# EAGLE design IceWerx Carrier Enzo Florendo (EAGLE 9.6.2)
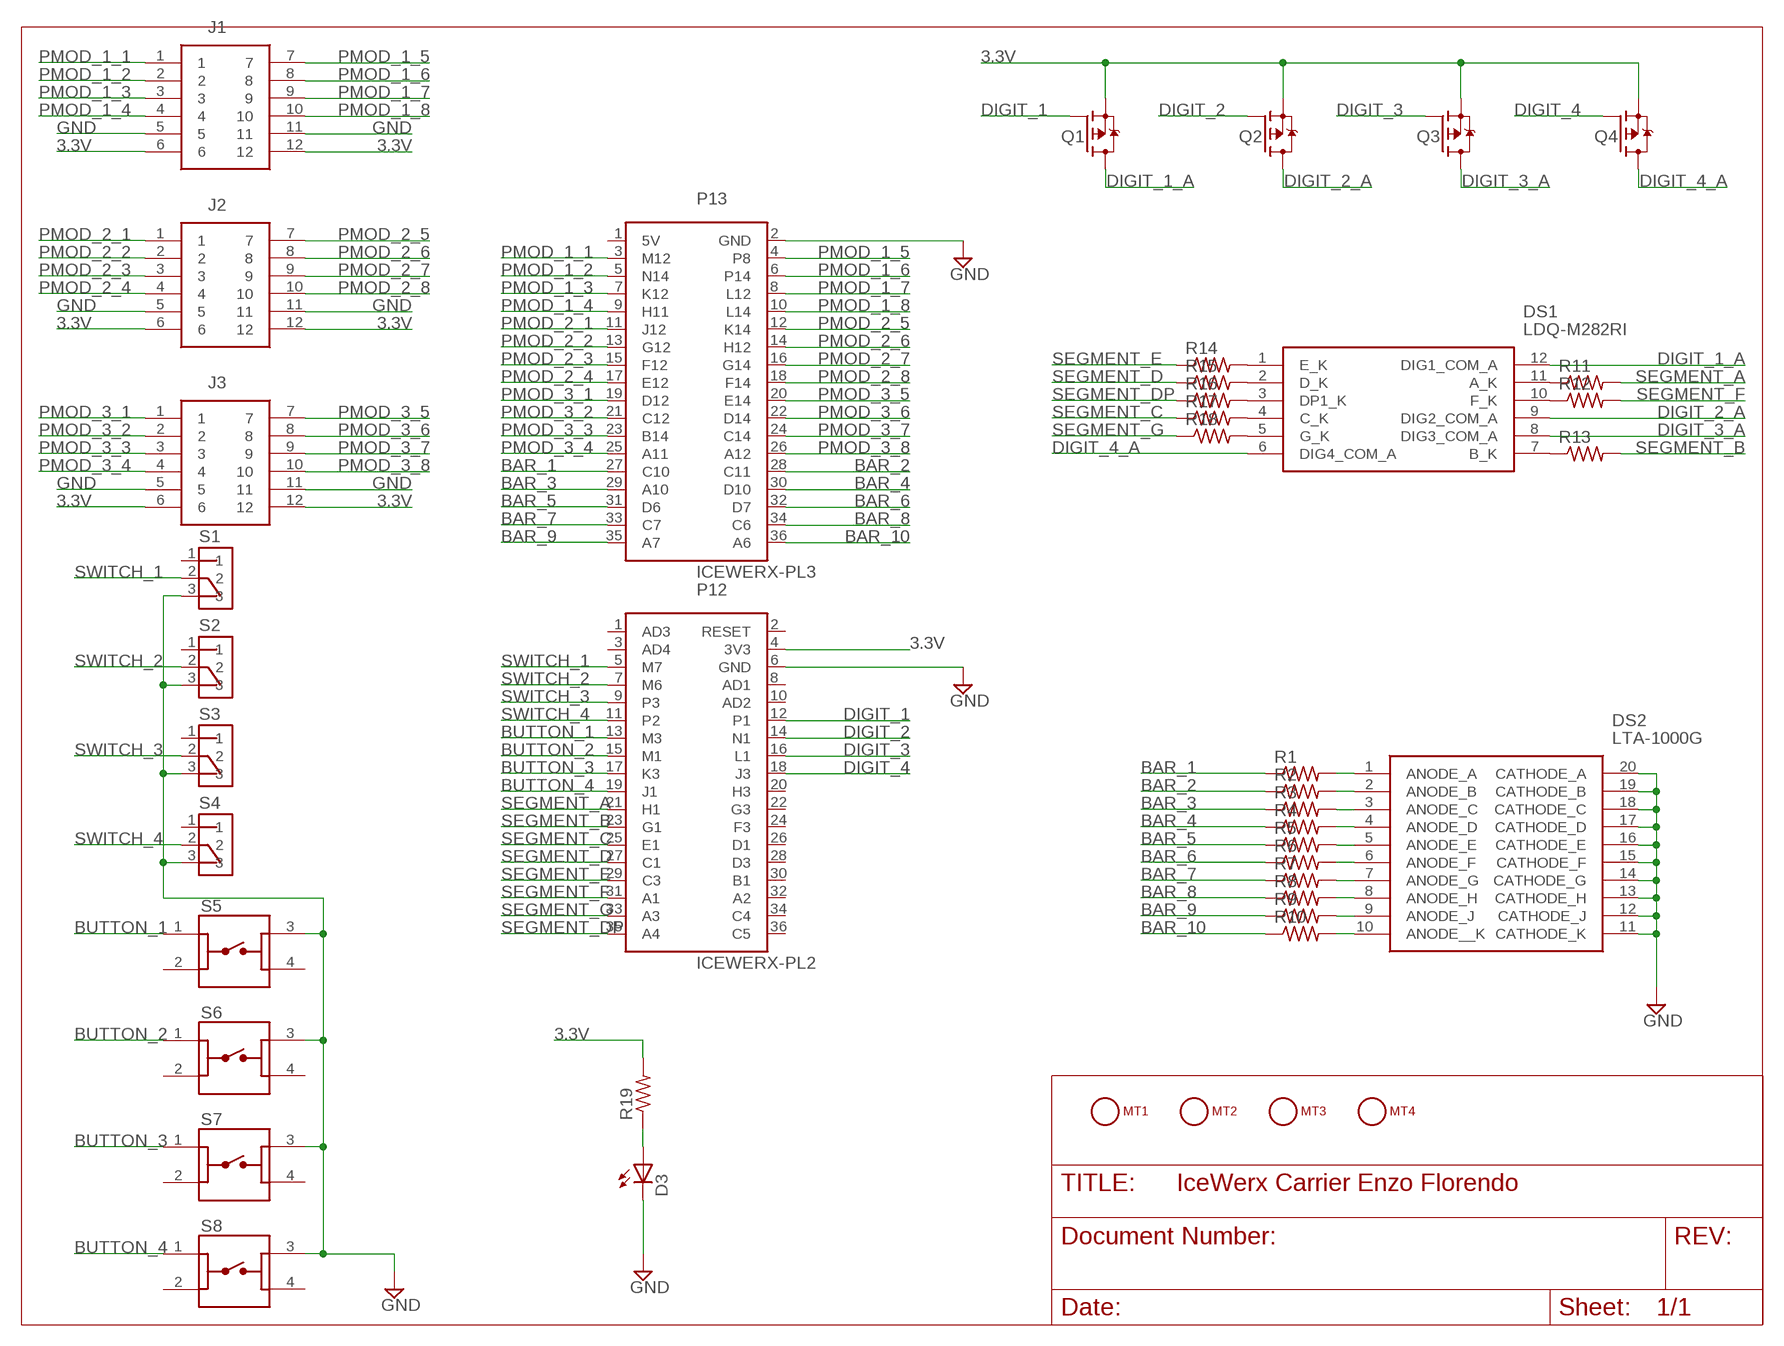
[diagram p0: schematic, sheet 1]

## Parts
D3  LED5MM  [LED5MM]
DS1  LDQ-M282RI  [LDQM282RI]
DS2  LTA-1000G  [DIPS762W50P254L2527H825Q20N]
J1  PMOD-SOCKET-FOR-HOST-BOARD  [PMOD-SOCKET-FOR-HOST-BOARD]
J2  PMOD-SOCKET-FOR-HOST-BOARD  [PMOD-SOCKET-FOR-HOST-BOARD]
J3  PMOD-SOCKET-FOR-HOST-BOARD  [PMOD-SOCKET-FOR-HOST-BOARD]
MT1  MOUNTING_HOLE-125_250_ROUND  [MT_125_250]
MT2  MOUNTING_HOLE-125_250_ROUND  [MT_125_250]
MT3  MOUNTING_HOLE-125_250_ROUND  [MT_125_250]
MT4  MOUNTING_HOLE-125_250_ROUND  [MT_125_250]
P12  ICEWERX-PL2  [TE_4-1734506-1]
P13  ICEWERX-PL3  [TE_4-1734506-1]
Q1  NX2301P  [SOT95P230X110-3N]
Q2  NX2301P  [SOT95P230X110-3N]
Q3  NX2301P  [SOT95P230X110-3N]
Q4  NX2301P  [SOT95P230X110-3N]
R1  R-US_0204/5  [0204/5]
R2  R-US_0204/5  [0204/5]
R3  R-US_0204/5  [0204/5]
R4  R-US_0204/5  [0204/5]
R5  R-US_0204/5  [0204/5]
R6  R-US_0204/5  [0204/5]
R7  R-US_0204/5  [0204/5]
R8  R-US_0204/5  [0204/5]
R9  R-US_0204/5  [0204/5]
R10  R-US_0204/5  [0204/5]
R11  R-US_0204/5  [0204/5]
R12  R-US_0204/5  [0204/5]
R13  R-US_0204/5  [0204/5]
R14  R-US_0204/5  [0204/5]
R15  R-US_0204/5  [0204/5]
R16  R-US_0204/5  [0204/5]
R17  R-US_0204/5  [0204/5]
R18  R-US_0204/5  [0204/5]
R19  R-US_0204/5  [0204/5]
S1  OS102011MS2QN1  [SW_OS102011MS2QN1]
S2  OS102011MS2QN1  [SW_OS102011MS2QN1]
S3  OS102011MS2QN1  [SW_OS102011MS2QN1]
S4  OS102011MS2QN1  [SW_OS102011MS2QN1]
S5  1825910-7  [SW_1825910-7]
S6  1825910-7  [SW_1825910-7]
S7  1825910-7  [SW_1825910-7]
S8  1825910-7  [SW_1825910-7]

## Nets
3.3V: J1.6 J1.12 J2.6 J2.12 J3.6 J3.12 P12.4(3V3) Q1.2(S) Q2.2(S) Q3.2(S) Q4.2(S) R19.2
BAR_1: P13.27(C10) R1.1
BAR_2: P13.28(C11) R2.1
BAR_3: P13.29(A10) R3.1
BAR_4: P13.30(D10) R4.1
BAR_5: P13.31(D6) R5.1
BAR_6: P13.32(D7) R6.1
BAR_7: P13.33(C7) R7.1
BAR_8: P13.34(C6) R8.1
BAR_9: P13.35(A7) R9.1
BAR_10: P13.36(A6) R10.1
BUTTON_1: P12.13(M3) S5.1
BUTTON_2: P12.15(M1) S6.1
BUTTON_3: P12.17(K3) S7.1
BUTTON_4: P12.19(J1) S8.1
DIGIT_1: P12.12(P1) Q1.1(G)
DIGIT_1_A: DS1.12(DIG1_COM_A) Q1.3(D)
DIGIT_2: P12.14(N1) Q2.1(G)
DIGIT_2_A: DS1.9(DIG2_COM_A) Q2.3(D)
DIGIT_3: P12.16(L1) Q3.1(G)
DIGIT_3_A: DS1.8(DIG3_COM_A) Q3.3(D)
DIGIT_4: P12.18(J3) Q4.1(G)
DIGIT_4_A: DS1.6(DIG4_COM_A) Q4.3(D)
GND: D3.K(C) DS2.11(CATHODE_K) DS2.12(CATHODE_J) DS2.13(CATHODE_H) DS2.14(CATHODE_G) DS2.15(CATHODE_F) DS2.16(CATHODE_E) DS2.17(CATHODE_D) DS2.18(CATHODE_C) DS2.19(CATHODE_B) DS2.20(CATHODE_A) J1.5 J1.11 J2.5 J2.11 J3.5 J3.11 P12.6(GND) P13.2(GND) S1.3 S2.3 S3.3 S4.3 S5.3 S6.3 S7.3 S8.3
N$3: D3.A R19.1
N$4: DS2.1(ANODE_A) R1.2
N$5: DS2.2(ANODE_B) R2.2
N$6: DS2.3(ANODE_C) R3.2
N$7: DS2.4(ANODE_D) R4.2
N$8: DS2.5(ANODE_E) R5.2
N$9: DS2.6(ANODE_F) R6.2
N$10: DS2.7(ANODE_G) R7.2
N$11: DS2.8(ANODE_H) R8.2
N$12: DS2.9(ANODE_J) R9.2
N$13: DS2.10(ANODE__K) R10.2
N$14: DS1.11(A_K) R11.1
N$15: DS1.10(F_K) R12.1
N$16: DS1.7(B_K) R13.1
N$17: DS1.1(E_K) R14.2
N$18: DS1.2(D_K) R15.2
N$19: DS1.3(DP1_K) R16.2
N$20: DS1.4(C_K) R17.2
N$21: DS1.5(G_K) R18.2
PMOD_1_1: J1.1 P13.3(M12)
PMOD_1_2: J1.2 P13.5(N14)
PMOD_1_3: J1.3 P13.7(K12)
PMOD_1_4: J1.4 P13.9(H11)
PMOD_1_5: J1.7 P13.4(P8)
PMOD_1_6: J1.8 P13.6(P14)
PMOD_1_7: J1.9 P13.8(L12)
PMOD_1_8: J1.10 P13.10(L14)
PMOD_2_1: J2.1 P13.11(J12)
PMOD_2_2: J2.2 P13.13(G12)
PMOD_2_3: J2.3 P13.15(F12)
PMOD_2_4: J2.4 P13.17(E12)
PMOD_2_5: J2.7 P13.12(K14)
PMOD_2_6: J2.8 P13.14(H12)
PMOD_2_7: J2.9 P13.16(G14)
PMOD_2_8: J2.10 P13.18(F14)
PMOD_3_1: J3.1 P13.19(D12)
PMOD_3_2: J3.2 P13.21(C12)
PMOD_3_3: J3.3 P13.23(B14)
PMOD_3_4: J3.4 P13.25(A11)
PMOD_3_5: J3.7 P13.20(E14)
PMOD_3_6: J3.8 P13.22(D14)
PMOD_3_7: J3.9 P13.24(C14)
PMOD_3_8: J3.10 P13.26(A12)
SEGMENT_A: P12.21(H1) R11.2
SEGMENT_B: P12.23(G1) R13.2
SEGMENT_C: P12.25(E1) R17.1
SEGMENT_D: P12.27(C1) R15.1
SEGMENT_DP: P12.35(A4) R16.1
SEGMENT_E: P12.29(C3) R14.1
SEGMENT_F: P12.31(A1) R12.2
SEGMENT_G: P12.33(A3) R18.1
SWITCH_1: P12.5(M7) S1.2
SWITCH_2: P12.7(M6) S2.2
SWITCH_3: P12.9(P3) S3.2
SWITCH_4: P12.11(P2) S4.2
Unconnected: MT1.1 MT2.1 MT3.1 MT4.1 P12.1(AD3) P12.2(RESET) P12.3(AD4) P12.8(AD1) P12.10(AD2) P12.20(H3) P12.22(G3) P12.24(F3) P12.26(D1) P12.28(D3) P12.30(B1) P12.32(A2) P12.34(C4) P12.36(C5) P13.1(5V) S1.1 S2.1 S3.1 S4.1 S5.2 S5.4 S6.2 S6.4 S7.2 S7.4 S8.2 S8.4

## Library data of the parts
D3 = eagle-library-engr-240-f22:LED: LED OSRAM: - CHIPLED LG R971, LG N971, LY N971, LG Q971, LY Q971, LO R971, LY R971 LH N974, LH R974 LS Q976, LO Q976, LY Q976 LO Q996 - Hyper CHIPLED LW Q18S LB Q993, LB Q99A, LB R99A - SideLED LS A670, LO A670, LY A670, LG A670, LP A670 LB A673, LV A673, LT A673, LW A673 LH A674 LY A675 LS A676, LA A676, LO A676, LY A676, LW A676 LS A679, LY A679, LG A679 - Hyper Micro SIDELED® LS Y876, LA Y876, LO Y876, LY Y876 LT Y87S - SmartLED LW L88C, LW L88S LB L89C, LB L89S, LG L890 LS L89K, LO L89K, LY L89K LS L896, LA L896, LO L896, LY L896 - TOPLED LS T670, LO T670, LY T670, LG T670, LP T670 LSG T670, LSP T670, LSY T670, LOP T670, LYG T670 LG T671, LOG T671, LSG T671 LB T673, LV T673, LT T673, LW T673 LH T674 LS T676, LA T676, LO T676, LY T676, LB T676, LH T676, LSB T676, LW T676 LB T67C, LV T67C, LT T67C, LS T67K, LO T67K, LY T67K, LW E67C LS E67B, LA E67B, LO E67B, LY E67B, LB E67C, LV E67C, LT E67C LW T67C LS T679, LY T679, LG T679 LS T770, LO T770, LY T770, LG T770, LP T770 LB T773, LV T773, LT T773, LW T773 LH T774 LS E675, LA E675, LY E675, LS T675 LS T776, LA T776, LO T776, LY T776, LB T776 LHGB T686 LT T68C, LB T68C - Hyper Mini TOPLED® LB M676 - Mini TOPLED Santana® LG M470 LS M47K, LO M47K, LY M47K Source: http://www.osram.convergy.de/
DS1 = eagle-library-engr-240-f22:LDQ-M282RI: LED Displays & Accessories LED Display Source: Datasheet <https://componentsearchengine.com/Datasheets/1/LDQ-M282RI.pdf>; DESCRIPTION: LED Displays & Accessories LED Display; HEIGHT: 6.05mm; MANUFACTURER_NAME: Lumex; MANUFACTURER_PART_NUMBER: LDQ-M282RI; MOUSER_PART_NUMBER: 696-LDQ-M282RI; MOUSER_PRICE-STOCK: https://www.mouser.com/Search/Refine.aspx?Keyword=696-LDQ-M282RI
DS2 = eagle-library-engr-240-f22:LTA-1000G: LED Uni-Color Green 565nm 20-Pin PDIP Source: Datasheet <https://optoelectronics.liteon.com/upload/download/DS-30-92-0809/A1000G.pdf>; DESCRIPTION: LED Uni-Color Green 565nm 20-Pin PDIP; HEIGHT: 8.25mm; MANUFACTURER_NAME: Lite-On; MANUFACTURER_PART_NUMBER: LTA-1000G; MOUSER_PART_NUMBER: 859-LTA-1000G; MOUSER_PRICE-STOCK: https://www.mouser.co.uk/ProductDetail/Lite-On/LTA-1000G?qs=%2FTKcI5XXRKq0QINzVmwJHg%3D%3D
J1-J3 = eagle-library-engr-240-f22:PMOD-SOCKET-FOR-HOST-BOARD
MT1-MT4 = eagle-library-engr-240-f22:MOUNTING_HOLE
P12 = eagle-library-engr-240-f22:ICEWERX-PL2
P13 = eagle-library-engr-240-f22:ICEWERX-PL3
Q1-Q4 = eagle-library-engr-240-f22:NX2301P; MANUFACTURER: Nexperia; MAXIMUM_PACKAGE_HEIGHT: 1.10 mm; PARTREV: 1; SNAPEDA_PN: NX2301P; STANDARD: IPC 7351B
R1-R19 = eagle-library-engr-240-f22:R-US_: RESISTOR, American symbol
S1-S4 = eagle-library-engr-240-f22:OS102011MS2QN1: Switch Slide ON ON SPDT Top Slide 0.1A 12VDC 10000Cycles PC Pins Thru-Hole Bulk; MANUFACTURER: C&K; STANDARD: MANUFACTURER RECOMMENDATIONS
S5-S8 = eagle-library-engr-240-f22:1825910-7: Switch Tactile OFF (ON) SPST Round Button PC Pins 0.05A 24VDC 100000Cycles 2.55N Thru-Hole Loose; MANUFACTURER: TE Connectivity; PARTREV: C10; STANDARD: Manufacturer Recommendation

## Board
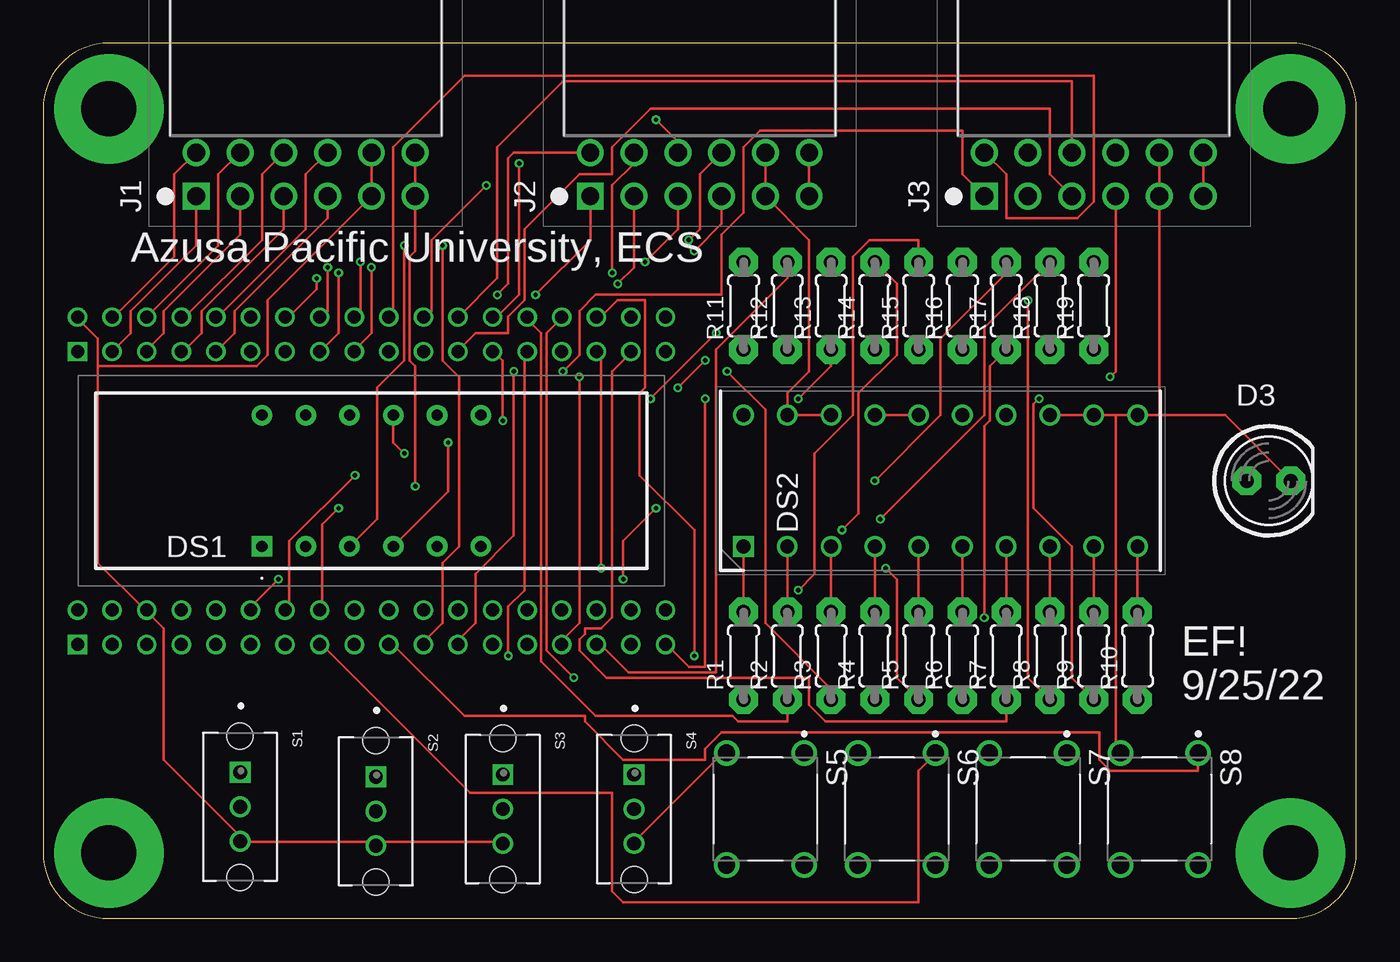
[diagram p1: board, top side]
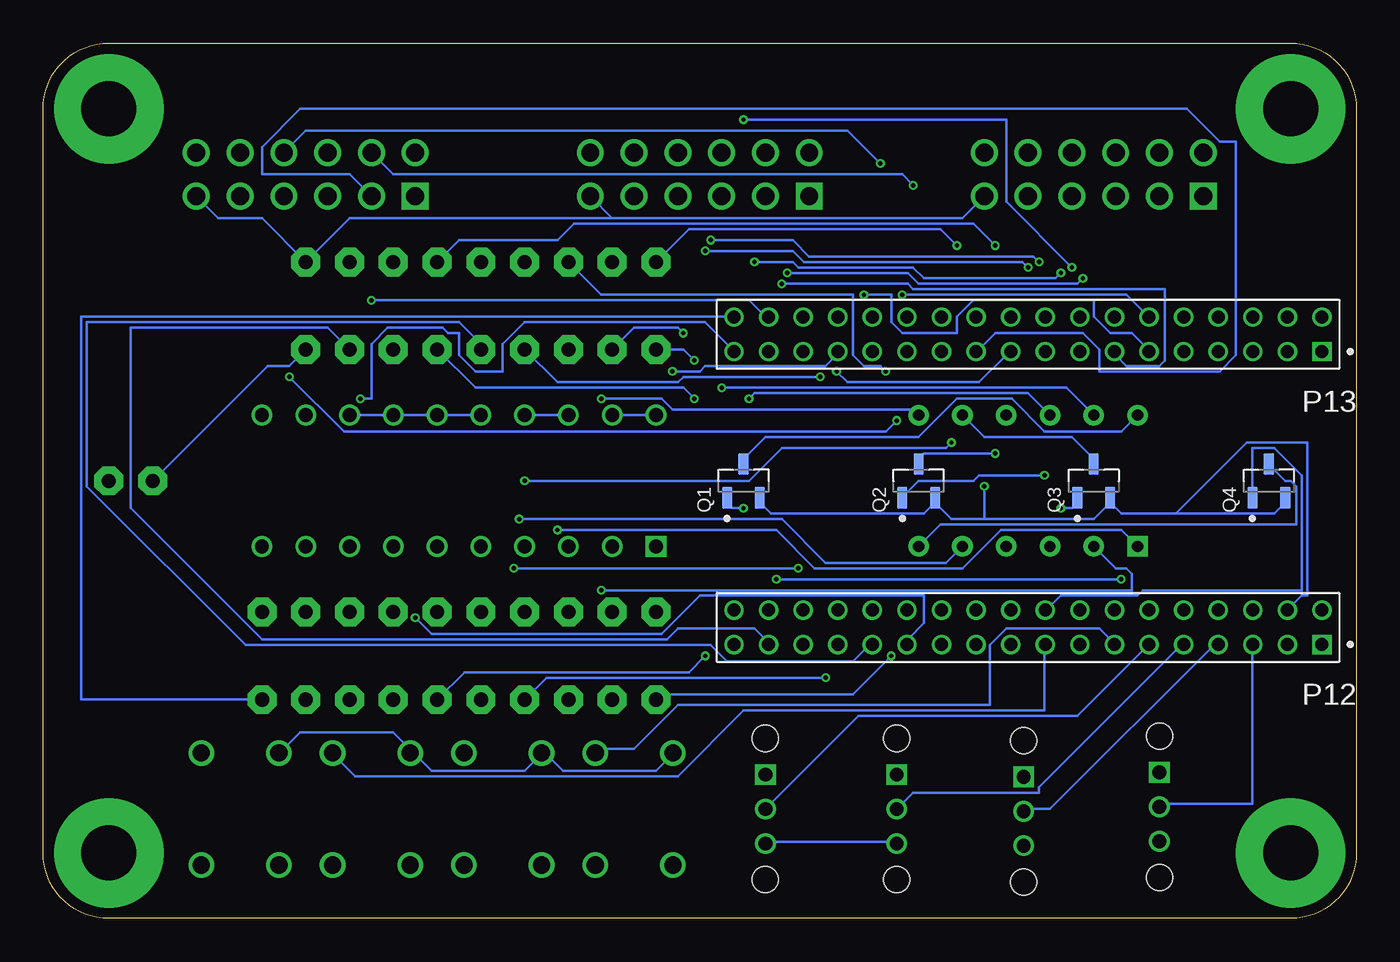
[diagram p2: board, bottom side, seen from below]

Size 76.2 x 50.8 mm. Coordinates in mm from the lower left corner, seen from the top.
Outline: 0,3.81 arc90 3.81,0 72.39,0 arc90 76.2,3.81 76.2,46.99 arc90 72.39,50.8 3.81,50.8 arc90 0,46.99 0,3.81
Copper layers (1*16): Top 0.035559375mm / dielectric 1.6mm / Bottom 0.035559375mm
Design rules "oshpark-2layer *": minimum track width 6mil, minimum drill 10mil, track to track 6mil, track to pad 6mil, pad to pad 6mil, via to via 6mil, smd to smd 6mil, copper to edge 15mil, drill to drill 6mil, minimum pad ring 5mil, minimum via ring 5mil, stop-mask expansion 2.5mil, vias tented up to drill 15mil, thermal gap 10mil

### Footprints (pad centres in the part's own frame; a part is rotated, then mirrored left to right if it is on the bottom)
LED5MM = drill 0.813 pad 1.676 octagon: A -1.27,0; K 1.27,0
LDQM282RI = drill 0.65 pad 1.192 square: 1 0,0 | drill 0.65 pad 1.192: 2 2.54,0; 3 5.08,0; 4 7.62,0; 5 10.16,0; 6 12.7,0; 7 12.7,7.62; 8 10.16,7.62; 9 7.62,7.62; 10 5.08,7.62; 11 2.54,7.62; 12 0,7.62
DIPS762W50P254L2527H825Q20N = drill 0.8 pad 1.2 square: 1 0,0 | drill 0.8 pad 1.2: 2 0,-2.54; 3 0,-5.08; 4 0,-7.62; 5 0,-10.16; 6 0,-12.7; 7 0,-15.24; 8 0,-17.78; 9 0,-20.32; 10 0,-22.86; 11 7.62,-22.86; 12 7.62,-20.32; 13 7.62,-17.78; 14 7.62,-15.24; 15 7.62,-12.7; 16 7.62,-10.16; 17 7.62,-7.62; 18 7.62,-5.08; 19 7.62,-2.54; 20 7.62,0
PMOD-SOCKET-FOR-HOST-BOARD = drill 1.04 pad 1.55 square: 1 0,0 | drill 1.04 pad 1.55: 2 2.54,0; 3 5.08,0; 4 7.62,0; 5 10.16,0; 6 12.7,0; 7 0,2.54; 8 2.54,2.54; 9 5.08,2.54; 10 7.62,2.54; 11 10.16,2.54; 12 12.7,2.54
MT_125_250 = drill 3.175 pad 6.35: 1 0,0
TE_4-1734506-1 = drill 0.75 pad 1.1 square: 1 0,0 | drill 0.75 pad 1.1: 2 0,-2; 3 2.007,0; 4 2.007,-2; 5 4.013,0; 6 4.013,-2; 7 6.02,0; 8 6.02,-2; 9 8.026,0; 10 8.026,-2; 11 10.033,0; 12 10.033,-2; 13 12.04,0; 14 12.04,-2; 15 14.046,0; 16 14.046,-2; 17 16.053,0; 18 16.053,-2; 19 18.059,0; 20 18.059,-2; 21 20.066,0; 22 20.066,-2; 23 22.073,0; 24 22.073,-2; 25 24.079,0; 26 24.079,-2; 27 26.086,0; 28 26.086,-2; 29 28.092,0; 30 28.092,-2; 31 30.099,0; 32 30.099,-2; 33 32.106,0; 34 32.106,-2; 35 34.112,0; 36 34.112,-2
SOT95P230X110-3N = smd 1.26 x 0.59: 1 -0.98,0.95; 2 -0.98,-0.95; 3 0.98,0
0204/5 = drill 0.813 pad 1.676 octagon: 1 -2.54,0; 2 2.54,0
SW_OS102011MS2QN1 = drill 0.8 square: 1 -2,0 | drill 0.8: 2 0,0; 3 2,0 | hole 1.5: -4.1,0; 4.1,0
SW_1825910-7 = drill 0.99: 1 -3.25,2.25; 2 3.25,2.25; 3 -3.25,-2.25; 4 3.25,-2.25

### Placement (x,y rotation side)
D3  71.12,25.4 0 top
DS1  12.7,21.59 0 top
DS2  40.64,21.59 90 top
J1  8.89,41.91 0 top
J2  31.75,41.91 0 top
J3  54.61,41.91 0 top
MT1  72.39,46.99 0 top
MT2  72.39,3.81 0 top
MT3  3.81,46.99 0 top
MT4  3.81,3.81 0 top
P12  2,15.9 180 bottom
P13  2,32.9 180 bottom
Q1  35.56,25.4 90 bottom
Q2  25.4,25.4 90 bottom
Q3  15.24,25.4 90 bottom
Q4  5.08,25.4 90 bottom
R1  40.64,15.24 90 top
R2  43.18,15.24 90 top
R3  45.72,15.24 90 top
R4  48.26,15.24 90 top
R5  50.8,15.24 90 top
R6  53.34,15.24 90 top
R7  55.88,15.24 90 top
R8  58.42,15.24 90 top
R9  60.96,15.24 90 top
R10  63.5,15.24 90 top
R11  40.64,35.56 90 top
R12  43.18,35.56 90 top
R13  45.72,35.56 90 top
R14  48.26,35.56 90 top
R15  50.8,35.56 90 top
R16  53.34,35.56 90 top
R17  55.88,35.56 90 top
R18  58.42,35.56 90 top
R19  60.96,35.56 90 top
S1  11.43,6.48 270 top
S2  19.3,6.22 270 top
S3  26.67,6.35 270 top
S4  34.29,6.35 270 top
S5  41.91,6.35 270 top
S6  49.53,6.35 270 top
S7  57.15,6.35 270 top
S8  64.77,6.35 270 top

### Tracks (layer width: path | path; a pad name or v marks a point on that pad's centre or on a via)
3.3V  (via drill 0.25)
  Top 0.152: J3.12 J3.6 | J1.12 J1.6 21.59,38.73 21.27,38.42 21.27,32.38 21.59,32.07 v21.59,25.08 | J2.12 J2.6
  Bottom 0.152: 24.45,24.13 25.08,23.5 33.97,23.5 34.61,24.13 Q1.2 | 10.48,23.5 13.65,23.5 14.29,24.13 | 10.48,23.5 4.76,23.5 4.13,24.13 Q4.2 | 10.48,23.5 6.35,27.62 2.86,27.62 2.86,18.73 3.17,18.73 3.81,18.1 P12.4 | 24.45,24.13 23.5,23.18 21.59,23.18 | 21.59,23.18 15.24,23.18 14.29,24.13 | 24.45,24.13 Q2.2 | 14.29,24.13 Q3.2 | J3.6 66.04,40.64 63.5,40.64 R19.2 58.42,40.64 43.18,40.64 | J1.6 22.86,40.64 43.18,40.64 | J2.6 43.18,40.64 | v21.59,25.08 21.59,23.18
BAR_1  (via drill 0.25)
  Top 0.152: v26.99,15.24 26.99,18.1 27.94,19.05 27.94,32.7 P13.27
  Bottom 0.152: v26.99,15.24 29.21,13.02 40.32,13.02 R1.1
BAR_2
  Top 0.152: R2.1 43.18,11.43 40.32,11.43 40.01,11.75 32.07,11.75 28.89,14.92 28.89,33.97 28.26,34.61 P13.28
BAR_3  (via drill 0.25)
  Top 0.152: v39.69,31.75 41.91,29.53 41.91,17.14 45.72,13.34 R3.1
  Bottom 0.152: v39.69,31.75 38.1,31.75 37.78,32.07 30.8,32.07 30.16,32.7 P13.29
BAR_4  (via drill 0.25)
  Top 0.152: v30.8,13.97 29.21,15.56 29.21,33.97 29.84,34.61 P13.30
  Bottom 0.152: v30.8,13.97 46.99,13.97 R4.1
BAR_5  (via drill 0.25)
  Top 0.152: v32.38,20.32 32.38,32.7 P13.31 | v48.9,20.32 49.53,19.68 49.53,13.97 R5.1
  Bottom 0.152: v48.9,20.32 v32.38,20.32
BAR_6  (via drill 0.25)
  Top 0.152: v37.78,15.24 37.78,22.54 34.61,25.72 34.61,30.48 34.92,30.8 34.92,35.88 33.34,35.88 32.38,34.92 P13.32
  Bottom 0.152: v37.78,15.24 38.73,14.29 51.75,14.29 R6.1
BAR_7
  Top 0.152: R7.1 55.88,11.43 45.4,11.43 44.45,12.38 44.45,13.97 32.7,13.97 31.11,15.56 31.11,16.19 31.43,16.51 31.43,16.83 32.38,16.83 33.02,17.46 33.02,31.75 33.97,32.7 P13.33
BAR_8  (via drill 0.25)
  Top 0.152: v57.15,35.88 57.15,13.97 R8.1
  Bottom 0.152: v57.15,35.88 35.24,35.88 34.29,34.92 P13.34
BAR_9  (via drill 0.25)
  Top 0.152: v57.78,30.16 57.47,29.84 57.47,23.81 59.69,21.59 59.69,13.97 R9.1
  Bottom 0.152: v57.78,30.16 57.15,30.16 57.15,33.34 56.2,34.29 53.02,34.29 52.7,33.97 52.07,33.97 52.07,32.7 51.12,31.75 49.53,31.75 49.53,33.34 48.26,34.61 37.78,34.61 36.2,33.02 P13.35
BAR_10
  Bottom 0.152: R10.1 73.98,12.7 73.98,34.92 36.2,34.92 P13.36
BUTTON_1
  Bottom 0.152: P12.13 14.29,16.19 14.92,16.83 20.32,16.83 21.27,15.88 21.27,12.38 39.37,12.38 41.91,9.84 44.13,9.84 S5.1
BUTTON_2
  Top 0.152: P12.15 16.19,15.88 24.77,7.3 33.02,7.3 33.02,1.59 33.66,0.95 50.8,0.95 50.8,8.57 51.75,9.53 S6.1
BUTTON_3
  Bottom 0.152: P12.17 18.1,15.88 18.1,12.06 35.56,12.06 39.37,8.26 58.1,8.26 59.37,9.53 S7.1
BUTTON_4
  Top 0.152: P12.19 20.32,15.88 24.45,11.75 31.43,11.75 31.43,11.43 33.66,9.21 38.42,9.21 38.42,9.84 39.37,10.79 61.28,10.79 61.28,9.21 61.91,8.57 66.99,8.57 66.99,9.53 S8.1
DIGIT_1  (via drill 0.25)
  Top 0.152: v35.56,23.81 33.66,21.91 v33.66,19.68 | v13.65,19.68 12.06,18.1 P12.12
  Bottom 0.152: v35.56,23.81 36.2,23.81 36.51,24.13 Q1.1 | v13.65,19.68 v33.66,19.68
DIGIT_1_A
  Bottom 0.152: DS1.12 13.65,28.26 18.1,28.26 20,30.16 23.18,30.16 25.4,27.94 34.29,27.94 35.56,26.67 Q1.3
DIGIT_2  (via drill 0.25)
  Top 0.152: v18.1,25.72 14.29,21.91 14.29,18.1 P12.14
  Bottom 0.152: v18.1,25.72 21.91,25.72 22.23,25.4 25.4,25.4 26.35,24.45 Q2.1
DIGIT_2_A  (via drill 0.25)
  Top 0.152: v20.95,26.99 20.32,27.62 DS1.9
  Bottom 0.152: v20.95,26.99 25.08,26.99 25.4,26.67 Q2.3
DIGIT_3  (via drill 0.25)
  Top 0.152: v17.14,23.81 16.19,22.86 16.19,18.1 P12.16
  Bottom 0.152: v17.14,23.81 16.51,23.81 16.19,24.13 Q3.1
DIGIT_3_A
  Bottom 0.152: DS1.8 21.59,27.94 16.51,27.94 15.24,26.67 Q3.3
DIGIT_4
  Bottom 0.152: Q4.1 6.03,24.45 6.03,27.3 4.76,27.3 3.17,25.72 3.17,19.05 12.38,19.05 12.7,18.73 17.14,18.73 17.78,18.1 P12.18
DIGIT_4_A
  Bottom 0.152: DS1.6 24.13,22.86 3.49,22.86 3.49,25.08 3.81,25.4 4.13,25.4 5.08,26.35 Q4.3
GND
  Top 0.152: J2.11 J2.5 44.45,39.37 44.45,31.75 43.18,30.48 DS2.19 DS2.18 | DS2.16 DS2.17 | J3.11 J3.5 64.77,29.21 | DS2.13 DS2.12 62.23,29.21 | 62.23,29.21 DS2.11 64.77,29.21 | D3.K 68.58,29.21 64.77,29.21 | S4.3 34.29,4.45 39.37,9.53 S5.3 | S3.3 26.67,4.45 19.37,4.45 S2.3 19.05,4.45 11.43,4.45 S1.3 11.43,4.76 6.99,9.21 6.99,16.83 6.03,17.78 P12.6 5.71,18.1 3.17,20.64 3.17,32.07 | J1.11 J1.5 13.02,35.88 13.02,32.7 12.38,32.07 3.17,32.07 | 3.17,32.07 3.17,33.66 2.22,34.61 P13.2 | 62.23,29.21 62.23,9.84 S8.3
  Bottom 0.152: DS2.19 DS2.20 | DS2.16 DS2.15 DS2.14 DS2.13 | DS2.17 DS2.18 | S8.3 62.23,9.84 61.28,10.79 55.88,10.79 54.93,9.84 S7.3 54.61,9.53 53.66,8.57 48.26,8.57 47.31,9.53 S6.3 46.99,9.53 46.04,8.57 40.64,8.57 39.69,9.53 S5.3 | S4.3 34.29,4.45 26.67,4.45 S3.3
N$3
  Bottom 0.152: R19.1 61.91,32.07 63.18,32.07 D3.A
N$4
  Top 0.152: R1.2 DS2.1
N$5
  Top 0.152: R2.2 DS2.2
N$6
  Top 0.152: R3.2 DS2.3
N$7
  Top 0.152: R4.2 DS2.4
N$8
  Top 0.152: R5.2 DS2.5
N$9
  Top 0.152: R6.2 DS2.6
N$10
  Top 0.152: R7.2 DS2.7
N$11
  Top 0.152: R8.2 DS2.8
N$12
  Top 0.152: R9.2 DS2.9
N$13
  Top 0.152: R10.2 DS2.10
N$14  (via drill 0.25)
  Top 0.152: v38.42,32.38 v36.83,30.8
  Bottom 0.152: DS1.11 16.83,30.8 v36.83,30.8 | v38.42,32.38 39.05,33.02 R11.1
N$15  (via drill 0.25)
  Top 0.152: v39.05,33.97 v35.24,30.16
  Bottom 0.152: DS1.10 19.05,30.48 34.92,30.48 v35.24,30.16 | v39.05,33.97 39.37,34.29 41.91,34.29 R12.1
N$16  (via drill 0.25)
  Top 0.152: v43.81,30.16 45.72,32.07 R13.1
  Bottom 0.152: DS1.7 25.72,29.53 39.69,29.53 40.32,30.16 v43.81,30.16
N$17  (via drill 0.25)
  Top 0.152: v46.35,22.54 47.31,23.5 47.31,30.48 49.53,32.7 49.53,36.83 R14.2
  Bottom 0.152: DS1.1 13.65,22.54 20.64,22.54 22.86,20.32 31.43,20.32 33.66,22.54 v46.35,22.54
N$18  (via drill 0.25)
  Top 0.152: v43.81,19.05 44.77,20 44.77,26.99 46.99,29.21 46.99,38.42 47.94,39.37 50.8,39.37 R15.2
  Bottom 0.152: DS1.2 13.97,20.32 13.34,20.32 13.02,20 13.02,19.05 v43.81,19.05
N$19  (via drill 0.25)
  Top 0.152: DS1.3 19.37,23.18 19.37,30.8 20.95,32.38 v20.95,39.05
  Bottom 0.152: v20.95,39.05 22.23,40.32 45.4,40.32 46.35,39.37 52.07,39.37 R16.2
N$20  (via drill 0.25)
  Top 0.152: DS1.4 23.5,24.77 v23.5,27.62 | v48.26,25.4 52.07,29.21 52.07,33.66 55.88,37.47 R17.2
  Bottom 0.152: v23.5,27.62 23.81,27.3 33.34,27.3 35.24,25.4 v48.26,25.4
N$21  (via drill 0.25)
  Top 0.152: v48.58,23.18 54.61,29.21 54.61,34.29 R18.2
  Bottom 0.152: DS1.5 23.81,20.64 30.8,20.64 33.34,23.18 v48.58,23.18
PMOD_1_1
  Top 0.152: J1.1 8.89,39.05 5.08,35.24 5.08,33.97 4.13,33.02 P13.3
PMOD_1_2
  Top 0.152: J1.2 11.43,39.69 6.99,35.24 6.99,33.97 6.03,33.02 P13.5
PMOD_1_3
  Top 0.152: J1.3 13.97,40.01 9.21,35.24 9.21,33.97 8.26,33.02 P13.7
PMOD_1_4
  Top 0.152: J1.4 16.51,40.64 11.11,35.24 11.11,33.97 10.16,33.02 P13.9
PMOD_1_5
  Top 0.152: J1.7 7.62,43.18 7.62,38.42 4.13,34.92 P13.4
PMOD_1_6
  Top 0.152: J1.8 10.16,43.18 10.16,39.05 6.03,34.92 P13.6
PMOD_1_7
  Top 0.152: J1.9 12.7,43.18 12.7,39.37 8.26,34.92 P13.8
PMOD_1_8
  Top 0.152: J1.10 15.24,43.18 15.24,40.01 10.16,34.92 P13.10
PMOD_2_1  (via drill 0.25)
  Top 0.152: v28.57,36.2 31.75,39.37 J2.1
  Bottom 0.152: v28.57,36.2 26.99,36.2 26.99,34.61 26.35,33.97 23.18,33.97 23.18,34.92 22.23,35.88 15.24,35.88 15.24,34.92 14.29,33.97 13.02,33.97 12.06,33.02 P13.11
PMOD_2_2  (via drill 0.25)
  Top 0.152: v33.34,36.83 34.29,37.78 J2.2
  Bottom 0.152: v33.34,36.83 26.04,36.83 25.72,36.51 11.11,36.51 11.11,32.38 11.43,32.07 13.34,32.07 13.97,32.7 P13.13
PMOD_2_3  (via drill 0.25)
  Top 0.152: v17.14,37.47 17.14,33.97 16.19,33.02 P13.15 | v34.92,38.1 36.83,40.01 J2.3
  Bottom 0.152: v17.14,37.47 17.46,37.15 25.08,37.15 25.72,37.78 32.38,37.78 32.7,38.1 v34.92,38.1
PMOD_2_4  (via drill 0.25)
  Top 0.152: v19.05,37.78 19.05,33.97 18.1,33.02 P13.17 | v37.78,38.73 39.37,40.32 J2.4
  Bottom 0.152: v19.05,37.78 19.37,38.1 32.07,38.1 32.7,38.73 v37.78,38.73
PMOD_2_5  (via drill 0.25)
  Top 0.152: v26.35,36.2 26.99,36.83 26.99,44.13 27.3,44.45 J2.7
  Bottom 0.152: v26.35,36.2 13.34,36.2 12.06,34.92 P13.12
PMOD_2_6  (via drill 0.25)
  Top 0.152: v15.88,37.15 15.88,36.51 14.29,34.92 P13.14 | v33.02,37.47 33.02,42.55 34.29,43.81 J2.8
  Bottom 0.152: v15.88,37.15 16.19,36.83 25.4,36.83 26.04,37.47 v33.02,37.47
PMOD_2_7  (via drill 0.25)
  Top 0.152: v16.51,37.78 16.51,35.24 16.19,34.92 P13.16 | v35.56,46.35 36.83,45.09 J2.9
  Bottom 0.152: v16.51,37.78 20.32,41.59 20.32,46.35 v35.56,46.35
PMOD_2_8  (via drill 0.25)
  Top 0.152: v18.41,38.1 18.41,35.24 18.1,34.92 P13.18 | v37.47,39.37 38.1,40.01 38.1,43.18 J2.10
  Bottom 0.152: v18.41,38.1 18.73,38.42 31.75,38.42 32.7,39.37 v37.47,39.37
PMOD_3_1  (via drill 0.25)
  Top 0.152: v30.16,31.75 31.11,32.7 31.11,35.24 32.07,36.2 39.37,36.2 39.37,39.69 40.64,40.96 40.64,44.77 41.59,45.72 53.34,45.72 53.34,43.18 J3.1
  Bottom 0.152: v30.16,31.75 29.53,31.11 21.91,31.11 20.32,32.7 P13.19
PMOD_3_2
  Bottom 0.152: J3.2 58.42,43.18 63.5,43.18 63.5,44.77 61.28,46.99 9.84,46.99 7.94,45.09 6.99,45.09 6.99,32.7 7.94,31.75 14.92,31.75 14.92,33.02 15.88,33.97 20.95,33.97 21.91,33.02 P13.21
PMOD_3_3
  Top 0.152: J3.3 58.42,43.18 58.42,46.99 35.24,46.99 33.02,44.77 33.02,43.18 31.11,43.18 27.94,40.01 27.94,35.88 26.99,34.92 26.99,33.97 25.08,33.97 24.13,33.02 P13.23
PMOD_3_4  (via drill 0.25)
  Top 0.152: v26.67,28.89 26.67,32.38 26.35,32.7 P13.25 | v61.91,31.43 62.23,31.75 J3.4
  Bottom 0.152: v26.67,28.89 27.3,28.26 58.74,28.26 v61.91,31.43
PMOD_3_5
  Top 0.152: J3.7 55.88,43.18 55.88,40.64 60.01,40.64 60.96,41.59 60.96,48.9 24.45,48.9 20.32,44.77 20.32,34.92 P13.20
PMOD_3_6  (via drill 0.25)
  Top 0.152: v25.72,42.55 22.54,39.37 22.54,35.24 22.23,34.92 P13.22
  Bottom 0.152: v25.72,42.55 26.35,43.18 55.88,43.18 J3.8
PMOD_3_7
  Top 0.152: J3.9 59.69,48.58 30.16,48.58 26.35,44.77 26.35,37.15 24.13,34.92 P13.24
PMOD_3_8  (via drill 0.25)
  Top 0.152: v27.62,43.81 27.62,36.2 26.35,34.92 P13.26
  Bottom 0.152: v27.62,43.81 29.53,45.72 60.96,45.72 J3.10
SEGMENT_A  (via drill 0.25)
  Top 0.152: v23.18,39.05 23.18,32.38 24.13,31.43 24.13,21.59 23.18,20.64 23.18,17.14 22.23,16.19 P12.21
  Bottom 0.152: v23.18,39.05 24.13,40.01 38.73,40.01 R11.2
SEGMENT_B  (via drill 0.25)
  Top 0.152: v27.3,31.75 27.3,22.23 25.08,20 25.08,17.14 24.13,16.19 P12.23
  Bottom 0.152: v27.3,31.75 27.62,32.07 28.57,32.07 29.21,32.7 29.21,36.2 43.81,36.2 R13.2
SEGMENT_C  (via drill 0.25)
  Top 0.152: v54.61,17.46 54.61,28.57 54.93,28.89 54.93,32.07 R17.1
  Bottom 0.152: v54.61,17.46 53.66,16.51 40.32,16.51 38.1,18.73 25.08,18.73 25.08,17.14 26.04,16.19 P12.25
SEGMENT_D
  Bottom 0.152: R15.1 50.8,33.34 52.07,34.61 73.66,34.61 73.66,25.08 64.45,15.88 37.47,15.88 36.51,14.92 29.21,14.92 28.26,15.88 P12.27
SEGMENT_DP  (via drill 0.25)
  Top 0.152: v38.42,30.16 38.42,14.61 37.47,14.61 36.2,15.88 P12.35
  Bottom 0.152: v38.42,30.16 39.05,30.8 51.12,30.8 R16.1
SEGMENT_E  (via drill 0.25)
  Top 0.152: v31.11,31.43 31.11,17.14 30.16,16.19 P12.29
  Bottom 0.152: v31.11,31.43 39.05,31.43 39.37,31.11 46.35,31.11 R14.1
SEGMENT_F
  Top 0.152: R12.2 43.18,37.15 39.05,33.02 39.05,14.29 33.97,14.29 32.38,15.88 P12.31
SEGMENT_G
  Bottom 0.152: R18.1 59.69,34.29 71.12,34.29 71.12,23.81 63.5,16.19 40.01,16.19 39.37,16.83 34.92,16.83 34.29,16.19 P12.33
SWITCH_1
  Bottom 0.152: P12.5 6.03,15.88 6.03,6.67 11.43,6.67 S1.2
SWITCH_2
  Bottom 0.152: P12.7 8.26,15.88 17.78,6.35 19.05,6.35 S2.2
SWITCH_3
  Bottom 0.152: S3.2 25.72,7.3 18.41,7.3 18.41,7.62 10.16,15.88 P12.9
SWITCH_4
  Bottom 0.152: S4.2 28.89,11.75 16.19,11.75 12.06,15.88 P12.11

### Text on the board
tPlace: Azusa Pacific University, ECS | EF! | 9/25/22